# Altium schematic sheet LPCB279 - TOP.SchDoc
size A3; Address1: Factory 10; Address2: 9-13 Dingley Avenue, Dandeong, VICTORIA 3175, AUSTRALIA; DocumentNumber: 1; Revision: 1; SheetNumber: 1; SheetTotal: 7; Lockie__PCB_SUB_ASSEMBLY: PCB Sub Component; Lockie__PCB_ASSEMBLY: PCB Assembly; Lockie__LDL: LPCB279; Lockie__PCB_DESCRIPTION: Landing Gear Unit
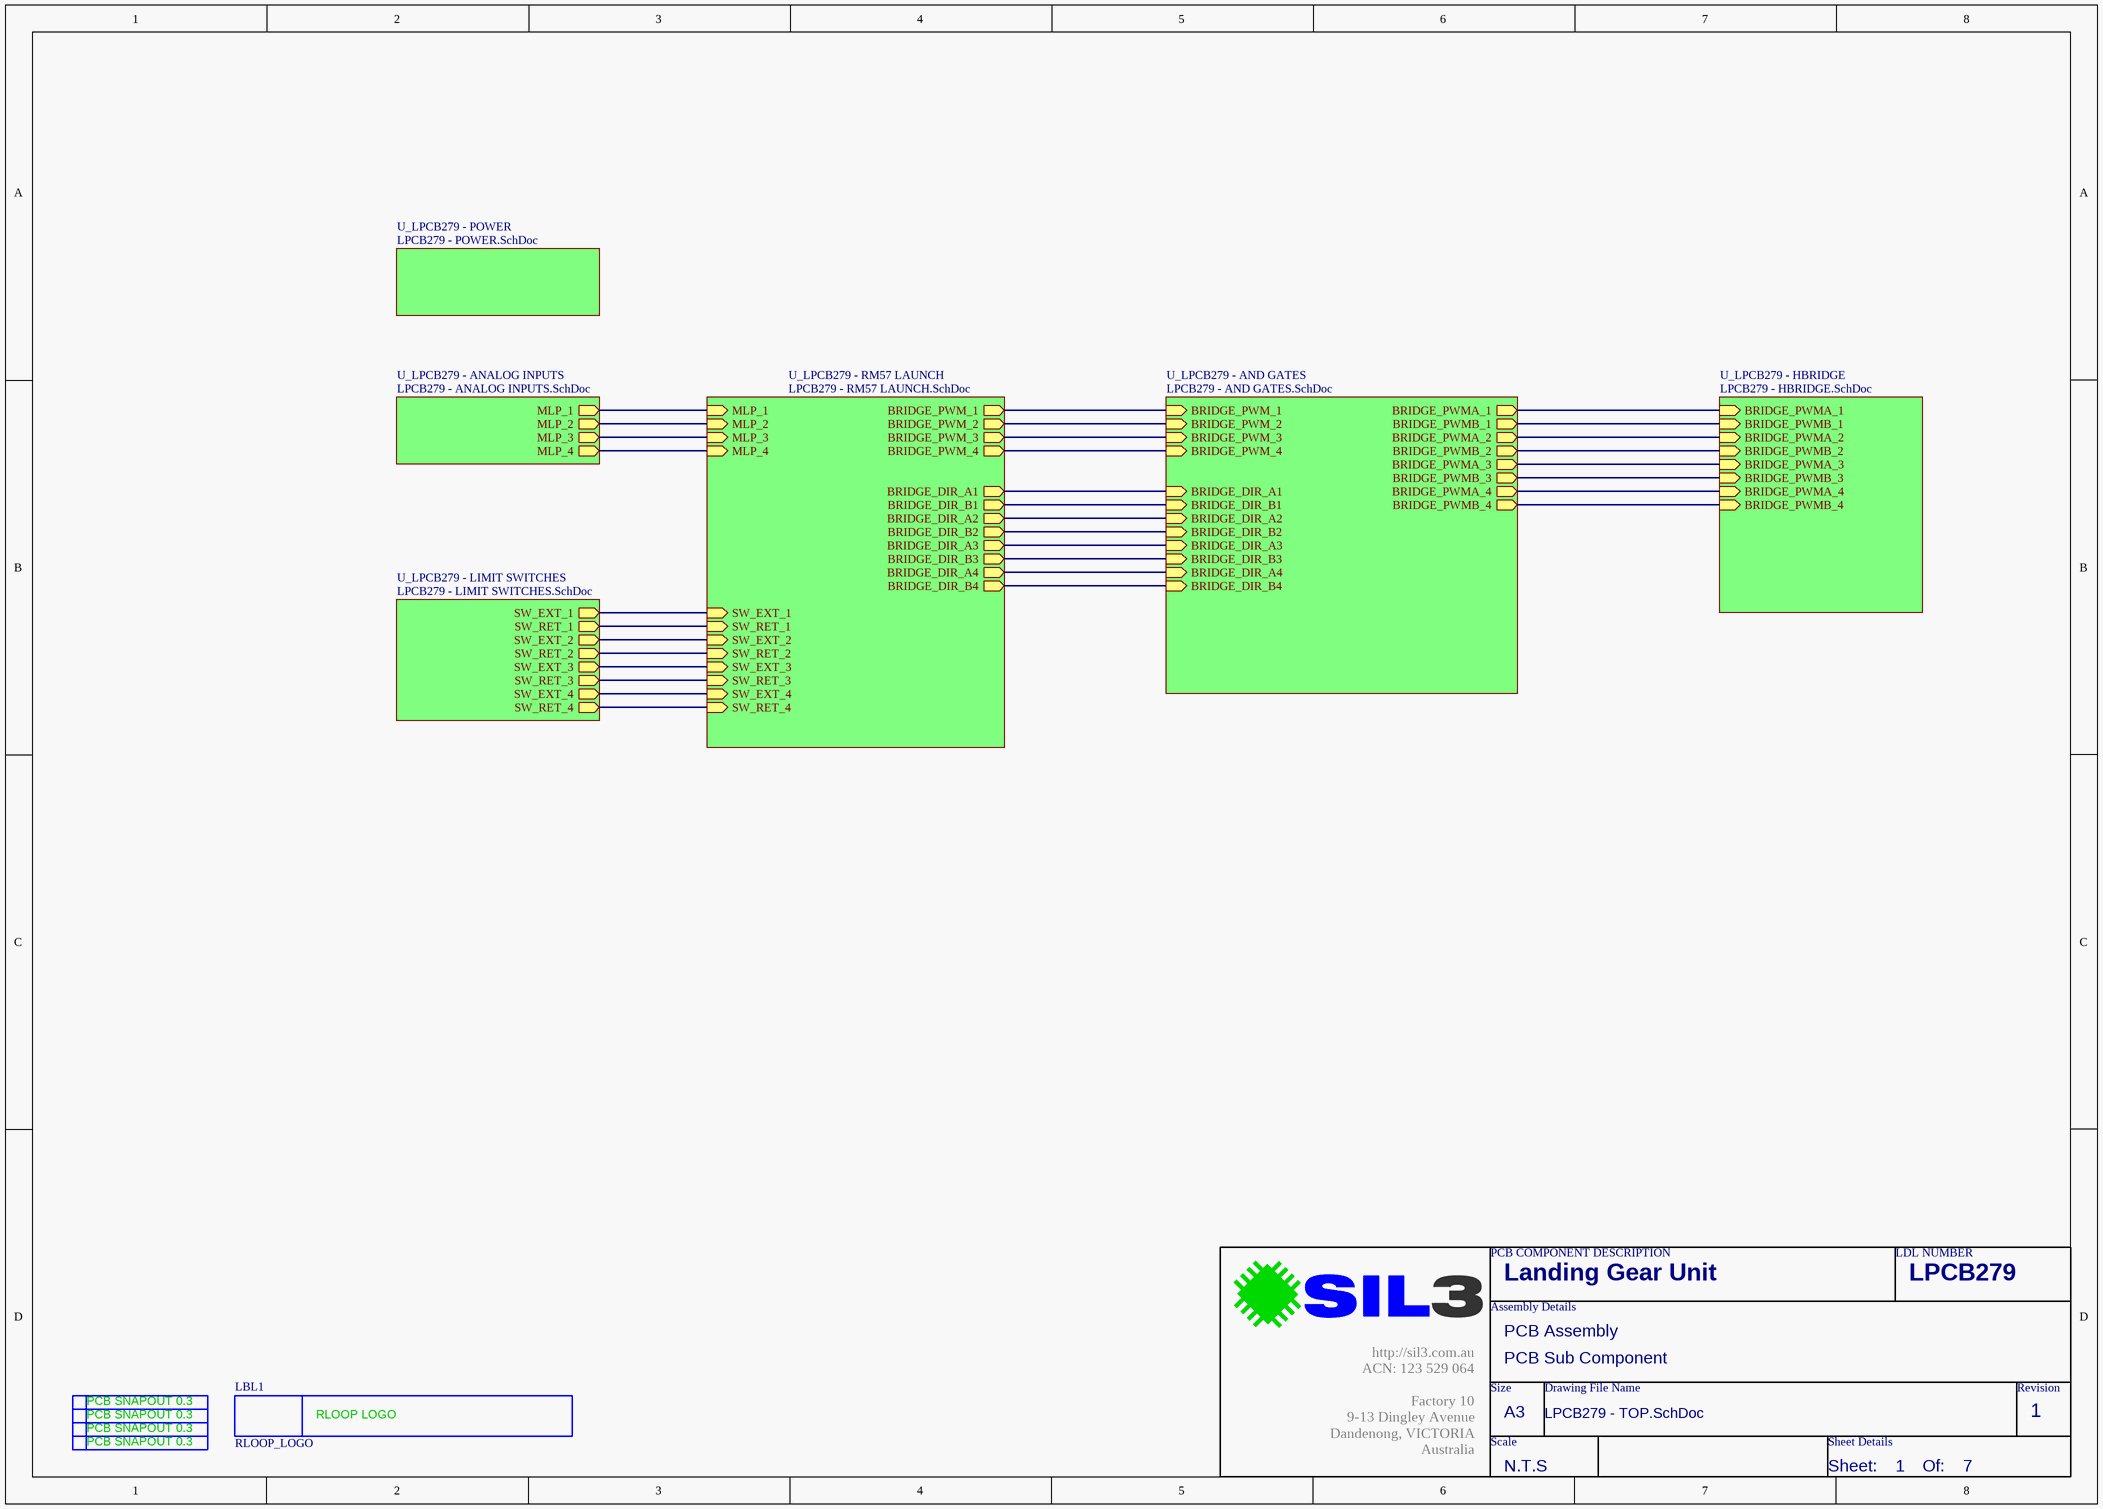
[diagram p0: LPCB279 - TOP.SchDoc]

## Parts
LBL1  RLOOP_LOGO  [RLOOP_LOGO]  (no BOM)
SN1  PCB_SNAPOUT_0.3MM  [PCB_SNAPOUT_0.3MM]  (value not drawn)  (no BOM)
SN2  PCB_SNAPOUT_0.3MM  [PCB_SNAPOUT_0.3MM]  (value not drawn)  (no BOM)
SN3  PCB_SNAPOUT_0.3MM  [PCB_SNAPOUT_0.3MM]  (value not drawn)  (no BOM)
SN4  PCB_SNAPOUT_0.3MM  [PCB_SNAPOUT_0.3MM]  (value not drawn)  (no BOM)

## Sub-sheets
U_LPCB279 - ANALOG INPUTS = LPCB279 - ANALOG INPUTS.SchDoc: MLP_1 (out), MLP_2 (out), MLP_3 (out), MLP_4 (out)
U_LPCB279 - AND GATES = LPCB279 - AND GATES.SchDoc: BRIDGE_PWM_1 (in), BRIDGE_DIR_A1 (in), BRIDGE_DIR_B1 (in), BRIDGE_PWMA_1 (out), BRIDGE_PWMB_1 (out), BRIDGE_PWM_2 (in), BRIDGE_DIR_A2 (in), BRIDGE_DIR_B2 (in), BRIDGE_PWMA_2 (out), BRIDGE_PWMB_2 (out), BRIDGE_PWM_3 (in), BRIDGE_DIR_A3 (in), BRIDGE_DIR_B3 (in), BRIDGE_PWMA_3 (out), BRIDGE_PWMB_3 (out), BRIDGE_PWM_4 (in), BRIDGE_DIR_A4 (in), BRIDGE_DIR_B4 (in), BRIDGE_PWMA_4 (out), BRIDGE_PWMB_4 (out)
U_LPCB279 - HBRIDGE = LPCB279 - HBRIDGE.SchDoc: BRIDGE_PWMA_1 (in), BRIDGE_PWMB_1 (in), BRIDGE_PWMA_2 (in), BRIDGE_PWMB_2 (in), BRIDGE_PWMA_3 (in), BRIDGE_PWMB_3 (in), BRIDGE_PWMA_4 (in), BRIDGE_PWMB_4 (in)
U_LPCB279 - LIMIT SWITCHES = LPCB279 - LIMIT SWITCHES.SchDoc: SW_EXT_1 (out), SW_RET_1 (out), SW_EXT_2 (out), SW_RET_2 (out), SW_EXT_3 (out), SW_RET_3 (out), SW_EXT_4 (out), SW_RET_4 (out)
U_LPCB279 - POWER = LPCB279 - POWER.SchDoc: no entries
U_LPCB279 - RM57 LAUNCH = LPCB279 - RM57 LAUNCH.SchDoc: MLP_1 (in), MLP_2 (in), MLP_3 (in), MLP_4 (in), SW_EXT_1 (in), SW_RET_1 (in), SW_EXT_2 (in), SW_RET_2 (in), SW_EXT_3 (in), SW_RET_3 (in), SW_EXT_4 (in), SW_RET_4 (in), BRIDGE_PWM_1 (out), BRIDGE_DIR_A1 (out), BRIDGE_PWM_2 (out), BRIDGE_DIR_A2 (out), BRIDGE_PWM_3 (out), BRIDGE_PWM_4 (out), BRIDGE_DIR_A4 (out), BRIDGE_DIR_B1 (out), BRIDGE_DIR_B2 (out), BRIDGE_DIR_A3 (out), BRIDGE_DIR_B4 (out), BRIDGE_DIR_B3 (out)

## Nets
(unnamed): sheet U_LPCB279 - ANALOG INPUTS/MLP_1, sheet U_LPCB279 - RM57 LAUNCH/MLP_1
(unnamed): sheet U_LPCB279 - ANALOG INPUTS/MLP_2, sheet U_LPCB279 - RM57 LAUNCH/MLP_2
(unnamed): sheet U_LPCB279 - ANALOG INPUTS/MLP_3, sheet U_LPCB279 - RM57 LAUNCH/MLP_3
(unnamed): sheet U_LPCB279 - ANALOG INPUTS/MLP_4, sheet U_LPCB279 - RM57 LAUNCH/MLP_4
(unnamed): sheet U_LPCB279 - LIMIT SWITCHES/SW_EXT_1, sheet U_LPCB279 - RM57 LAUNCH/SW_EXT_1
(unnamed): sheet U_LPCB279 - LIMIT SWITCHES/SW_RET_1, sheet U_LPCB279 - RM57 LAUNCH/SW_RET_1
(unnamed): sheet U_LPCB279 - LIMIT SWITCHES/SW_EXT_2, sheet U_LPCB279 - RM57 LAUNCH/SW_EXT_2
(unnamed): sheet U_LPCB279 - LIMIT SWITCHES/SW_RET_2, sheet U_LPCB279 - RM57 LAUNCH/SW_RET_2
(unnamed): sheet U_LPCB279 - LIMIT SWITCHES/SW_EXT_3, sheet U_LPCB279 - RM57 LAUNCH/SW_EXT_3
(unnamed): sheet U_LPCB279 - LIMIT SWITCHES/SW_RET_3, sheet U_LPCB279 - RM57 LAUNCH/SW_RET_3
(unnamed): sheet U_LPCB279 - LIMIT SWITCHES/SW_EXT_4, sheet U_LPCB279 - RM57 LAUNCH/SW_EXT_4
(unnamed): sheet U_LPCB279 - LIMIT SWITCHES/SW_RET_4, sheet U_LPCB279 - RM57 LAUNCH/SW_RET_4
(unnamed): sheet U_LPCB279 - HBRIDGE/BRIDGE_PWMA_1, sheet U_LPCB279 - AND GATES/BRIDGE_PWMA_1
(unnamed): sheet U_LPCB279 - HBRIDGE/BRIDGE_PWMB_1, sheet U_LPCB279 - AND GATES/BRIDGE_PWMB_1
(unnamed): sheet U_LPCB279 - HBRIDGE/BRIDGE_PWMA_2, sheet U_LPCB279 - AND GATES/BRIDGE_PWMA_2
(unnamed): sheet U_LPCB279 - HBRIDGE/BRIDGE_PWMB_2, sheet U_LPCB279 - AND GATES/BRIDGE_PWMB_2
(unnamed): sheet U_LPCB279 - HBRIDGE/BRIDGE_PWMA_3, sheet U_LPCB279 - AND GATES/BRIDGE_PWMA_3
(unnamed): sheet U_LPCB279 - HBRIDGE/BRIDGE_PWMB_3, sheet U_LPCB279 - AND GATES/BRIDGE_PWMB_3
(unnamed): sheet U_LPCB279 - HBRIDGE/BRIDGE_PWMA_4, sheet U_LPCB279 - AND GATES/BRIDGE_PWMA_4
(unnamed): sheet U_LPCB279 - HBRIDGE/BRIDGE_PWMB_4, sheet U_LPCB279 - AND GATES/BRIDGE_PWMB_4
(unnamed): sheet U_LPCB279 - RM57 LAUNCH/BRIDGE_PWM_1, sheet U_LPCB279 - AND GATES/BRIDGE_PWM_1
(unnamed): sheet U_LPCB279 - RM57 LAUNCH/BRIDGE_DIR_A1, sheet U_LPCB279 - AND GATES/BRIDGE_DIR_A1
(unnamed): sheet U_LPCB279 - RM57 LAUNCH/BRIDGE_PWM_2, sheet U_LPCB279 - AND GATES/BRIDGE_PWM_2
(unnamed): sheet U_LPCB279 - RM57 LAUNCH/BRIDGE_DIR_A2, sheet U_LPCB279 - AND GATES/BRIDGE_DIR_A2
(unnamed): sheet U_LPCB279 - RM57 LAUNCH/BRIDGE_PWM_3, sheet U_LPCB279 - AND GATES/BRIDGE_PWM_3
(unnamed): sheet U_LPCB279 - RM57 LAUNCH/BRIDGE_PWM_4, sheet U_LPCB279 - AND GATES/BRIDGE_PWM_4
(unnamed): sheet U_LPCB279 - RM57 LAUNCH/BRIDGE_DIR_A4, sheet U_LPCB279 - AND GATES/BRIDGE_DIR_A4
(unnamed): sheet U_LPCB279 - RM57 LAUNCH/BRIDGE_DIR_B1, sheet U_LPCB279 - AND GATES/BRIDGE_DIR_B1
(unnamed): sheet U_LPCB279 - RM57 LAUNCH/BRIDGE_DIR_B2, sheet U_LPCB279 - AND GATES/BRIDGE_DIR_B2
(unnamed): sheet U_LPCB279 - RM57 LAUNCH/BRIDGE_DIR_A3, sheet U_LPCB279 - AND GATES/BRIDGE_DIR_A3
(unnamed): sheet U_LPCB279 - RM57 LAUNCH/BRIDGE_DIR_B4, sheet U_LPCB279 - AND GATES/BRIDGE_DIR_B4
(unnamed): sheet U_LPCB279 - RM57 LAUNCH/BRIDGE_DIR_B3, sheet U_LPCB279 - AND GATES/BRIDGE_DIR_B3

## Notes on the sheet
- PCB COMPONENT DESCRIPTION
- LDL NUMBER
- Assembly Details
- Size
- Drawing File Name
- Revision
- http://sil3.com.au
  ACN: 123 529 064
  Factory 10
  9-13 Dingley Avenue
  Dandenong, VICTORIA
  Australia
- Scale
- A3
- Sheet Details
- N.T.S
- Sheet:
- Of:
- (in symbol PCB_SNAPOUT_0.3MM) PCB SNAPOUT 0.3
- (in symbol RLOOP_LOGO) RLOOP LOGO

## Library data of the parts
LBL1 = RLOOP_LOGO: FMEDA__CHANNEL: DIAG; FMEDA__FUNCTION_IN_SYSTEM: *
SN1-SN4 = PCB_SNAPOUT_0.3MM: PCB Snapout + 0.3mm; FMEDA__CHANNEL: DIAG; FMEDA__FUNCTION_IN_SYSTEM: *